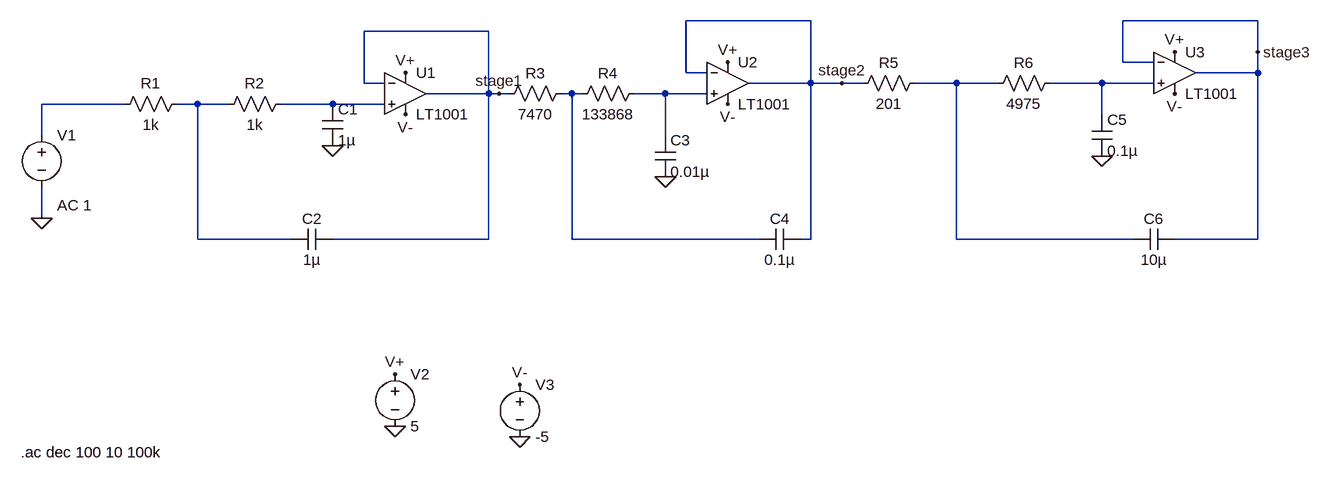
[diagram p0: schematic sixthbutterworth.asc]
sixthbutterworth.asc, the LTspice schematic file:
Version 4
SHEET 1 1880 680
WIRE 1136 0 944 0
WIRE 1824 0 1616 0
WIRE 640 16 448 16
WIRE 1824 48 1824 0
WIRE 1616 64 1616 0
WIRE 1664 64 1616 64
WIRE 944 80 944 0
WIRE 976 80 944 80
WIRE 1824 80 1824 48
WIRE 1824 80 1728 80
WIRE 448 96 448 16
WIRE 480 96 448 96
WIRE 1136 96 1136 0
WIRE 1136 96 1040 96
WIRE 1184 96 1136 96
WIRE 1216 96 1184 96
WIRE 1360 96 1296 96
WIRE 1424 96 1360 96
WIRE 1584 96 1504 96
WIRE 1664 96 1584 96
WIRE 640 112 640 16
WIRE 640 112 544 112
WIRE 656 112 640 112
WIRE 672 112 656 112
WIRE 768 112 752 112
WIRE 784 112 768 112
WIRE 912 112 864 112
WIRE 976 112 912 112
WIRE 80 128 -48 128
WIRE 192 128 160 128
WIRE 240 128 192 128
WIRE 400 128 320 128
WIRE 480 128 400 128
WIRE 1584 144 1584 96
WIRE -48 176 -48 128
WIRE 912 176 912 112
WIRE -48 304 -48 256
WIRE 192 336 192 128
WIRE 336 336 192 336
WIRE 640 336 640 112
WIRE 640 336 400 336
WIRE 768 336 768 112
WIRE 1056 336 768 336
WIRE 1136 336 1136 96
WIRE 1136 336 1120 336
WIRE 1360 336 1360 96
WIRE 1632 336 1360 336
WIRE 1824 336 1824 80
WIRE 1824 336 1696 336
FLAG -48 304 0
FLAG 912 240 0
FLAG 1584 208 0
FLAG 1008 64 V+
FLAG 1696 48 V+
FLAG 1008 128 V-
FLAG 1696 112 V-
FLAG 496 544 V+
FLAG 688 560 V-
FLAG 400 192 0
FLAG 512 80 V+
FLAG 512 144 V-
FLAG 688 640 0
FLAG 496 624 0
FLAG 656 112 stage1
FLAG 1184 96 stage2
FLAG 1824 48 stage3
SYMBOL res 176 112 R90
WINDOW 0 0 56 VBottom 2
WINDOW 3 32 56 VTop 2
SYMATTR InstName R1
SYMATTR Value 1k
SYMBOL res 336 112 R90
WINDOW 0 0 56 VBottom 2
WINDOW 3 32 56 VTop 2
SYMATTR InstName R2
SYMATTR Value 1k
SYMBOL cap 384 128 R0
SYMATTR InstName C1
SYMATTR Value 1µ
SYMBOL OpAmps\\LT1001 512 48 R0
SYMATTR InstName U1
SYMBOL cap 400 320 R90
WINDOW 0 0 32 VBottom 2
WINDOW 3 32 32 VTop 2
SYMATTR InstName C2
SYMATTR Value 1µ
SYMBOL voltage -48 160 R0
WINDOW 123 24 124 Left 2
WINDOW 39 0 0 Left 0
SYMATTR InstName V1
SYMATTR Value ""
SYMATTR Value2 AC 1
SYMBOL voltage 496 528 R0
WINDOW 123 0 0 Left 0
WINDOW 39 0 0 Left 0
SYMATTR InstName V2
SYMATTR Value 5
SYMBOL voltage 688 544 R0
WINDOW 123 0 0 Left 0
WINDOW 39 0 0 Left 0
SYMATTR InstName V3
SYMATTR Value -5
SYMBOL res 768 96 R90
WINDOW 0 0 56 VBottom 2
WINDOW 3 32 56 VTop 2
SYMATTR InstName R3
SYMATTR Value 7470
SYMBOL res 880 96 R90
WINDOW 0 0 56 VBottom 2
WINDOW 3 32 56 VTop 2
SYMATTR InstName R4
SYMATTR Value 133868
SYMBOL OpAmps\\LT1001 1008 32 R0
SYMATTR InstName U2
SYMBOL cap 896 176 R0
SYMATTR InstName C3
SYMATTR Value 0.01µ
SYMBOL cap 1120 320 R90
WINDOW 0 0 32 VBottom 2
WINDOW 3 32 32 VTop 2
SYMATTR InstName C4
SYMATTR Value 0.1µ
SYMBOL res 1312 80 R90
WINDOW 0 0 56 VBottom 2
WINDOW 3 32 56 VTop 2
SYMATTR InstName R5
SYMATTR Value 201
SYMBOL res 1520 80 R90
WINDOW 0 0 56 VBottom 2
WINDOW 3 32 56 VTop 2
SYMATTR InstName R6
SYMATTR Value 4975
SYMBOL cap 1568 144 R0
SYMATTR InstName C5
SYMATTR Value 0.1µ
SYMBOL cap 1696 320 R90
WINDOW 0 0 32 VBottom 2
WINDOW 3 32 32 VTop 2
SYMATTR InstName C6
SYMATTR Value 10µ
SYMBOL OpAmps\\LT1001 1696 16 R0
SYMATTR InstName U3
TEXT -80 664 Left 2 !.ac dec 100 10 100k

The netlist it stands for:
* sixthbutterworth.asc
R1 N006 N005 1k
R2 N007 N006 1k
C1 N007 0 1µ
XU1 N007 stage1 V+ V- stage1 LT1001  ; pins In+ In- V+ V- OUT
C2 stage1 N006 1µ
V1 N005 0 AC 1
V2 V+ 0 5
V3 V- 0 -5
R3 N003 stage1 7470
R4 N004 N003 133868
XU2 N004 stage2 V+ V- stage2 LT1001  ; pins In+ In- V+ V- OUT
C3 N004 0 0.01µ
C4 stage2 N003 0.1µ
R5 N001 stage2 201
R6 N002 N001 4975
C5 N002 0 0.1µ
C6 stage3 N001 10µ
XU3 N002 stage3 V+ V- stage3 LT1001  ; pins In+ In- V+ V- OUT
.ac dec 100 10 100k
.lib LTC.lib
.backanno
.end